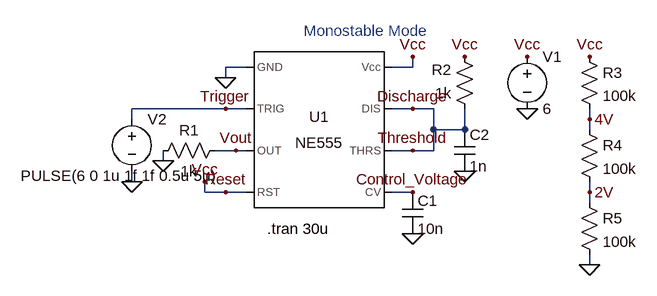
[diagram p0: schematic Monostable.asc]
Monostable.asc, the LTspice schematic file:
Version 4
SHEET 1 880 680
WIRE 64 80 32 80
WIRE 320 80 320 64
WIRE 320 80 288 80
WIRE 32 96 32 80
WIRE 32 144 -112 144
WIRE 64 144 32 144
WIRE 320 144 288 144
WIRE 352 144 320 144
WIRE -112 160 -112 144
WIRE 592 160 592 144
WIRE 352 176 352 144
WIRE 400 176 400 144
WIRE 400 176 352 176
WIRE 592 176 592 160
WIRE 48 208 16 208
WIRE 64 208 48 208
WIRE 320 208 288 208
WIRE 352 208 352 176
WIRE 352 208 320 208
WIRE -64 224 -64 208
WIRE -112 256 -112 240
WIRE 0 272 0 256
WIRE 32 272 0 272
WIRE 64 272 32 272
WIRE 320 272 288 272
WIRE 592 272 592 256
WIRE 592 288 592 272
WIRE 592 384 592 368
FLAG 496 144 0
FLAG 496 64 Vcc
FLAG 320 64 Vcc
FLAG 32 96 0
FLAG -64 224 0
FLAG 320 336 0
FLAG -112 256 0
FLAG 32 144 Trigger
FLAG 48 208 Vout
FLAG 32 272 Reset
FLAG 320 272 Control_Voltage
FLAG 320 208 Threshold
FLAG 320 144 Discharge
FLAG 592 384 0
FLAG 592 64 Vcc
FLAG 592 272 2V
FLAG 592 160 4V
FLAG 0 256 Vcc
FLAG 400 64 Vcc
FLAG 400 240 0
SYMBOL Misc\\NE555 176 176 R0
SYMATTR InstName U1
SYMBOL voltage 496 48 R0
WINDOW 123 0 0 Left 2
WINDOW 39 0 0 Left 2
SYMATTR InstName V1
SYMATTR Value 6
SYMBOL res 32 192 R90
WINDOW 0 0 56 VBottom 2
WINDOW 3 32 56 VTop 2
SYMATTR InstName R1
SYMATTR Value 1k
SYMBOL cap 304 272 R0
WINDOW 0 24 13 Left 2
SYMATTR InstName C1
SYMATTR Value 10n
SYMBOL res 416 160 R180
WINDOW 0 36 76 Left 2
WINDOW 3 36 40 Left 2
SYMATTR InstName R2
SYMATTR Value 1k
SYMBOL voltage -112 144 R0
WINDOW 3 -171 103 Left 2
WINDOW 123 0 0 Left 2
WINDOW 39 0 0 Left 2
SYMATTR Value PULSE(6 0 1u 1f 1f 0.5u 5u)
SYMATTR InstName V2
SYMBOL res 576 48 R0
SYMATTR InstName R3
SYMATTR Value 100k
SYMBOL res 576 160 R0
SYMATTR InstName R4
SYMATTR Value 100k
SYMBOL res 576 272 R0
SYMATTR InstName R5
SYMATTR Value 100k
SYMBOL cap 384 176 R0
SYMATTR InstName C2
SYMATTR Value 1n
TEXT 96 328 Left 2 !.tran 30u
TEXT 152 24 Left 2 ;Monostable Mode

The netlist it stands for:
* Monostable.asc
XU1 0 Trigger Vout Reset Control_Voltage Discharge Discharge Reset NE555  ; pins GND TRIG OUT RST CV THRS DIS Vcc
V1 Reset 0 6
R1 Vout 0 1k
C1 Control_Voltage 0 10n
R2 Discharge Reset 1k
V2 Trigger 0 PULSE(6 0 1u 1f 1f 0.5u 5u)
R3 Reset 4V 100k
R4 4V 2V 100k
R5 2V 0 100k
C2 Discharge 0 1n
.tran 30u
* Monostable Mode
.lib NE555.sub
.backanno
.end